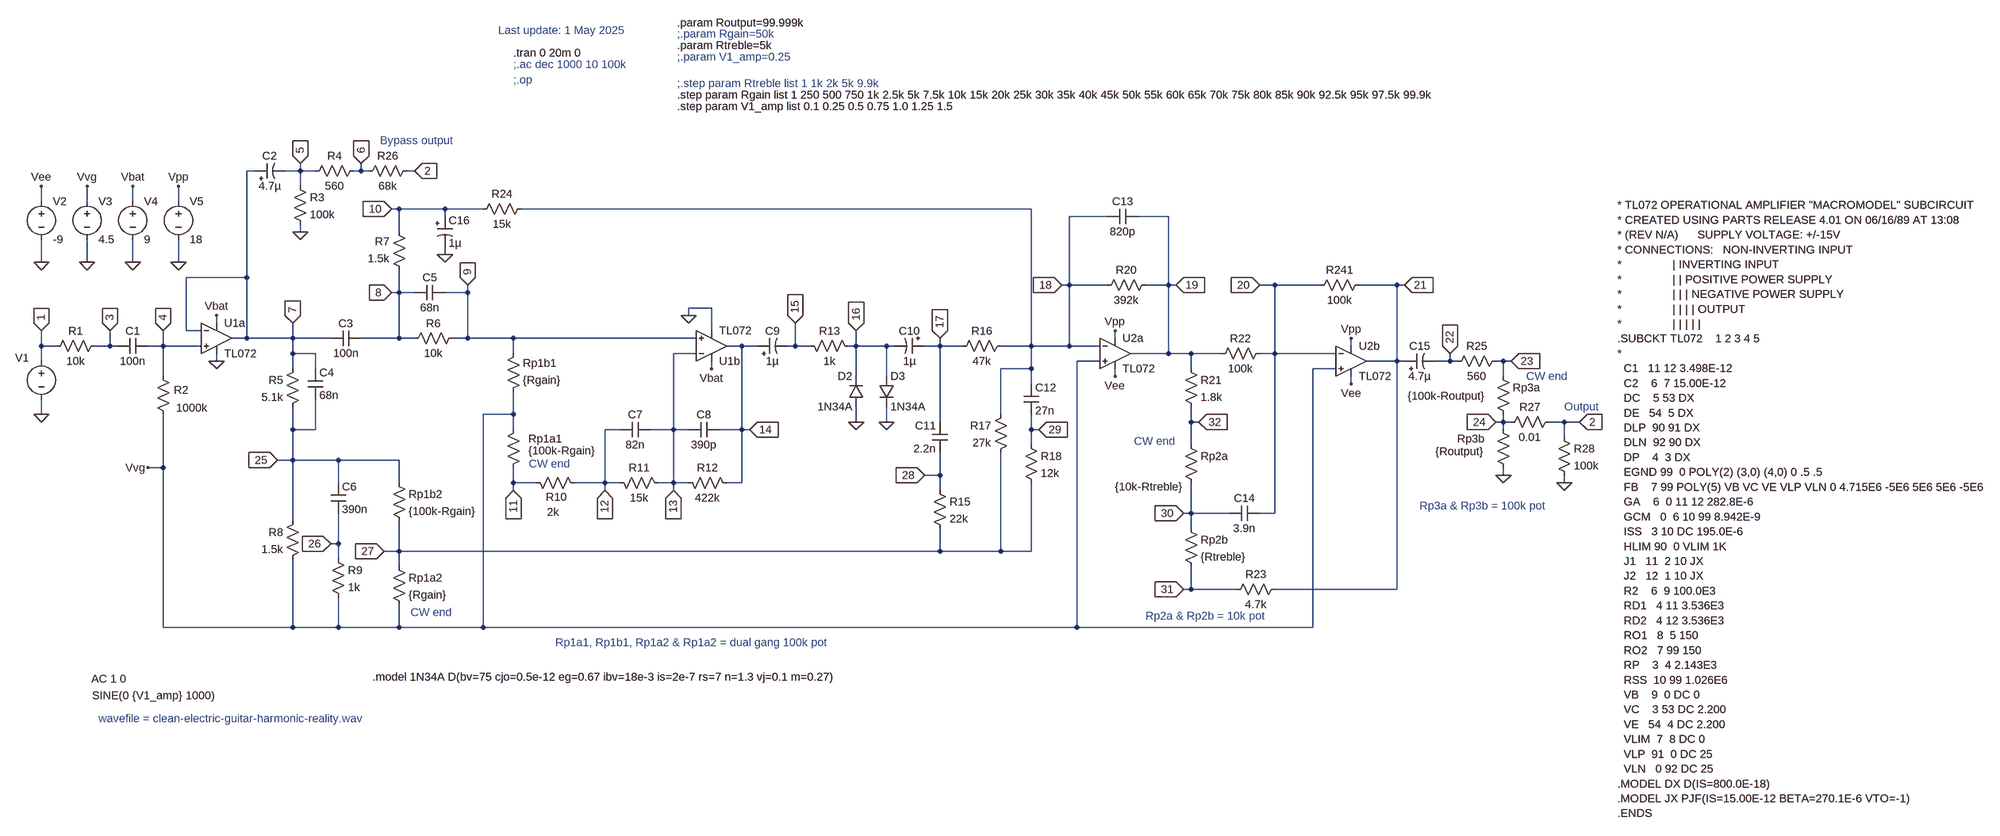
[diagram p0: schematic Klon-Centaur_v2_gain_input_sweep.asc]
Klon-Centaur_v2_gain_input_sweep.asc, the LTspice schematic file:
Version 4
SHEET 1 4760 5064
WIRE -336 2208 -352 2208
WIRE -240 2208 -240 2192
WIRE -240 2208 -272 2208
WIRE -208 2208 -240 2208
WIRE -112 2208 -112 2192
WIRE -112 2208 -128 2208
WIRE -96 2208 -112 2208
WIRE 0 2208 -16 2208
WIRE -240 2240 -240 2208
WIRE -784 2272 -784 2240
WIRE -688 2272 -688 2240
WIRE -592 2272 -592 2240
WIRE -496 2272 -496 2240
WIRE -32 2288 -48 2288
WIRE 64 2288 -32 2288
WIRE 144 2288 64 2288
WIRE 1296 2288 224 2288
WIRE 64 2304 64 2288
WIRE 1456 2304 1376 2304
WIRE 1584 2304 1520 2304
WIRE -240 2336 -240 2320
WIRE -32 2336 -32 2288
WIRE 64 2384 64 2368
WIRE -784 2400 -784 2352
WIRE -688 2400 -688 2352
WIRE -592 2400 -592 2352
WIRE -496 2400 -496 2352
WIRE -352 2432 -352 2208
WIRE -352 2432 -480 2432
WIRE 1376 2448 1376 2304
WIRE 1376 2448 1360 2448
WIRE 1456 2448 1376 2448
WIRE 1584 2448 1584 2304
WIRE 1584 2448 1536 2448
WIRE 1600 2448 1584 2448
WIRE 1808 2448 1776 2448
WIRE 1904 2448 1808 2448
WIRE 2064 2448 1984 2448
WIRE 2080 2448 2064 2448
WIRE -32 2464 -32 2416
WIRE -32 2464 -48 2464
WIRE 0 2464 -32 2464
WIRE 112 2464 112 2448
WIRE 112 2464 64 2464
WIRE 624 2496 576 2496
WIRE 576 2512 576 2496
WIRE -416 2528 -416 2512
WIRE -480 2544 -480 2432
WIRE -448 2544 -480 2544
WIRE 624 2544 624 2496
WIRE -352 2560 -352 2432
WIRE -352 2560 -384 2560
WIRE -256 2560 -256 2528
WIRE -256 2560 -352 2560
WIRE -176 2560 -256 2560
WIRE -32 2560 -32 2464
WIRE -32 2560 -112 2560
WIRE 0 2560 -32 2560
WIRE 112 2560 112 2464
WIRE 112 2560 80 2560
WIRE 208 2560 112 2560
WIRE 592 2560 208 2560
WIRE 1472 2560 1472 2544
WIRE -784 2576 -784 2544
WIRE -752 2576 -784 2576
WIRE -640 2576 -640 2544
WIRE -640 2576 -672 2576
WIRE -624 2576 -640 2576
WIRE -528 2576 -528 2544
WIRE -528 2576 -560 2576
WIRE -448 2576 -528 2576
WIRE 688 2576 656 2576
WIRE 720 2576 688 2576
WIRE 800 2576 800 2528
WIRE 800 2576 784 2576
WIRE 832 2576 800 2576
WIRE 928 2576 928 2544
WIRE 928 2576 912 2576
WIRE 992 2576 928 2576
WIRE 1008 2576 992 2576
WIRE 1104 2576 1104 2560
WIRE 1104 2576 1072 2576
WIRE 1152 2576 1104 2576
WIRE 1296 2576 1296 2288
WIRE 1296 2576 1232 2576
WIRE 1376 2576 1376 2448
WIRE 1376 2576 1296 2576
WIRE 1440 2576 1376 2576
WIRE 1968 2576 1968 2560
WIRE -256 2592 -256 2560
WIRE -208 2592 -256 2592
WIRE 208 2592 208 2560
WIRE 592 2592 544 2592
WIRE 1584 2592 1584 2448
WIRE 1584 2592 1504 2592
WIRE 1632 2592 1584 2592
WIRE 1696 2592 1632 2592
WIRE 1808 2592 1808 2448
WIRE 1808 2592 1776 2592
WIRE 1936 2592 1808 2592
WIRE -784 2608 -784 2576
WIRE -416 2608 -416 2592
WIRE 1440 2608 1392 2608
WIRE 2064 2608 2064 2448
WIRE 2064 2608 2000 2608
WIRE 2080 2608 2064 2608
WIRE 2176 2608 2176 2592
WIRE 2176 2608 2144 2608
WIRE 2192 2608 2176 2608
WIRE 2288 2608 2272 2608
WIRE 2304 2608 2288 2608
WIRE -256 2624 -256 2592
WIRE -208 2624 -208 2592
WIRE 624 2624 624 2608
WIRE 1296 2624 1296 2576
WIRE 1296 2624 1232 2624
WIRE 1632 2624 1632 2592
WIRE 1936 2624 1888 2624
WIRE -528 2640 -528 2576
WIRE 928 2640 928 2576
WIRE 992 2640 992 2576
WIRE 1472 2640 1472 2624
WIRE 2288 2640 2288 2608
WIRE 1296 2656 1296 2624
WIRE 1968 2656 1968 2640
WIRE -784 2720 -784 2688
WIRE 208 2720 208 2672
WIRE 208 2720 144 2720
WIRE 1232 2720 1232 2624
WIRE 928 2736 928 2704
WIRE 992 2736 992 2704
WIRE 1104 2736 1104 2576
WIRE 1632 2736 1632 2704
WIRE 1648 2736 1632 2736
WIRE 2288 2736 2288 2720
WIRE 2288 2736 2272 2736
WIRE 2304 2736 2288 2736
WIRE 2416 2736 2384 2736
WIRE 2448 2736 2416 2736
WIRE -256 2752 -256 2704
WIRE -208 2752 -208 2688
WIRE -208 2752 -256 2752
WIRE 208 2752 208 2720
WIRE 432 2752 400 2752
WIRE 544 2752 544 2592
WIRE 544 2752 496 2752
WIRE 576 2752 544 2752
WIRE 688 2752 688 2576
WIRE 688 2752 640 2752
WIRE 704 2752 688 2752
WIRE 1296 2752 1296 2720
WIRE 1312 2752 1296 2752
WIRE 2288 2752 2288 2736
WIRE 2416 2768 2416 2736
WIRE 1296 2784 1296 2752
WIRE 1632 2784 1632 2736
WIRE -256 2816 -256 2752
WIRE -256 2816 -288 2816
WIRE -160 2816 -256 2816
WIRE -32 2816 -160 2816
WIRE -528 2832 -528 2720
WIRE -528 2832 -560 2832
WIRE 1104 2848 1104 2800
WIRE 1104 2848 1072 2848
WIRE 2288 2848 2288 2832
WIRE -160 2864 -160 2816
WIRE -32 2864 -32 2816
WIRE 208 2864 208 2832
WIRE 256 2864 208 2864
WIRE 400 2864 400 2752
WIRE 400 2864 336 2864
WIRE 432 2864 400 2864
WIRE 544 2864 544 2752
WIRE 544 2864 512 2864
WIRE 576 2864 544 2864
WIRE 688 2864 688 2752
WIRE 688 2864 656 2864
WIRE 2416 2864 2416 2848
WIRE 208 2880 208 2864
WIRE 400 2880 400 2864
WIRE 544 2880 544 2864
WIRE 1104 2880 1104 2848
WIRE 1632 2928 1632 2864
WIRE 1632 2928 1616 2928
WIRE 1712 2928 1632 2928
WIRE 1808 2928 1808 2592
WIRE 1808 2928 1776 2928
WIRE -256 2944 -256 2816
WIRE 1632 2960 1632 2928
WIRE -160 2992 -160 2928
WIRE -160 2992 -176 2992
WIRE -32 3008 -32 2944
WIRE -32 3008 -64 3008
WIRE 1104 3008 1104 2960
WIRE 1104 3008 -32 3008
WIRE 1232 3008 1232 2800
WIRE 1232 3008 1104 3008
WIRE 1296 3008 1296 2864
WIRE 1296 3008 1232 3008
WIRE -160 3024 -160 2992
WIRE -32 3040 -32 3008
WIRE 1632 3088 1632 3040
WIRE 1632 3088 1616 3088
WIRE 1728 3088 1632 3088
WIRE 2064 3088 2064 2608
WIRE 2064 3088 1808 3088
WIRE -528 3168 -528 2832
WIRE -256 3168 -256 3024
WIRE -256 3168 -528 3168
WIRE -160 3168 -160 3104
WIRE -160 3168 -256 3168
WIRE -32 3168 -32 3120
WIRE -32 3168 -160 3168
WIRE 144 3168 144 2720
WIRE 144 3168 -32 3168
WIRE 1392 3168 1392 2608
WIRE 1392 3168 144 3168
WIRE 1888 3168 1888 2624
WIRE 1888 3168 1392 3168
FLAG -784 2544 1
IOPIN -784 2544 In
FLAG 992 2736 0
FLAG 928 2736 0
FLAG 64 2384 0
FLAG 2448 2736 2
IOPIN 2448 2736 In
FLAG -784 2720 0
FLAG 2416 2864 0
FLAG -640 2544 3
IOPIN -640 2544 In
FLAG -528 2544 4
IOPIN -528 2544 In
FLAG -256 2528 7
IOPIN -256 2528 In
FLAG -48 2464 8
IOPIN -48 2464 In
FLAG -48 2288 10
IOPIN -48 2288 In
FLAG 112 2448 9
IOPIN 112 2448 In
FLAG 800 2528 15
IOPIN 800 2528 In
FLAG 928 2544 16
IOPIN 928 2544 In
FLAG 1104 2560 17
IOPIN 1104 2560 In
FLAG 1072 2848 28
IOPIN 1072 2848 In
FLAG 1312 2752 29
IOPIN 1312 2752 In
FLAG -64 3008 27
IOPIN -64 3008 In
FLAG -176 2992 26
IOPIN -176 2992 In
FLAG -288 2816 25
IOPIN -288 2816 In
FLAG 1648 2736 32
IOPIN 1648 2736 In
FLAG 1616 2928 30
IOPIN 1616 2928 In
FLAG 1616 3088 31
IOPIN 1616 3088 In
FLAG 1360 2448 18
IOPIN 1360 2448 In
FLAG 1600 2448 19
IOPIN 1600 2448 In
FLAG 1776 2448 20
IOPIN 1776 2448 In
FLAG 2080 2448 21
IOPIN 2080 2448 In
FLAG 2176 2592 22
IOPIN 2176 2592 In
FLAG -784 2400 0
FLAG -688 2400 0
FLAG -592 2400 0
FLAG -496 2400 0
FLAG -784 2240 Vee
FLAG -688 2240 Vvg
FLAG -592 2240 Vbat
FLAG -496 2240 Vpp
FLAG -416 2512 Vbat
FLAG 624 2624 Vbat
FLAG -416 2608 0
FLAG 576 2512 0
FLAG 1472 2544 Vpp
FLAG 1968 2560 Vpp
FLAG 1472 2640 Vee
FLAG 1968 2656 Vee
FLAG -560 2832 Vvg
FLAG -240 2336 0
FLAG -240 2192 5
IOPIN -240 2192 In
FLAG 0 2208 2
IOPIN 0 2208 In
FLAG -112 2192 6
IOPIN -112 2192 In
FLAG 2288 2848 0
FLAG 2272 2736 24
IOPIN 2272 2736 In
FLAG 2304 2608 23
IOPIN 2304 2608 In
FLAG 208 2880 11
IOPIN 208 2880 In
FLAG 400 2880 12
IOPIN 400 2880 In
FLAG 544 2880 13
IOPIN 544 2880 In
FLAG 704 2752 14
IOPIN 704 2752 In
SYMBOL voltage -784 2592 R0
WINDOW 0 -55 9 Left 2
WINDOW 123 105 684 Left 2
WINDOW 39 0 0 Left 0
WINDOW 3 107 719 Left 2
SYMATTR InstName V1
SYMATTR Value2 AC 1 0
SYMATTR Value SINE(0 {V1_amp} 1000)
SYMBOL res -656 2560 R90
WINDOW 0 0 56 VBottom 2
WINDOW 3 32 56 VTop 2
SYMATTR InstName R1
SYMATTR Value 10k
SYMBOL res -512 2736 R180
WINDOW 0 -37 67 Left 2
WINDOW 3 -77 30 Left 2
SYMATTR InstName R2
SYMATTR Value 1000k
SYMBOL cap -560 2560 R90
WINDOW 0 0 32 VBottom 2
WINDOW 3 32 32 VTop 2
SYMATTR InstName C1
SYMATTR Value 100n
SYMBOL res -240 2608 M0
SYMATTR InstName R5
SYMATTR Value 5.1k
SYMBOL res -240 2928 M0
SYMATTR InstName R8
SYMATTR Value 1.5k
SYMBOL cap -112 2544 R90
WINDOW 0 0 32 VBottom 2
WINDOW 3 32 32 VTop 2
SYMATTR InstName C3
SYMATTR Value 100n
SYMBOL cap -224 2624 R0
SYMATTR InstName C4
SYMATTR Value 68n
SYMBOL cap -176 2864 R0
SYMATTR InstName C6
SYMATTR Value 390n
SYMBOL res -176 3008 R0
SYMATTR InstName R9
SYMATTR Value 1k
SYMBOL res 96 2544 R90
WINDOW 0 0 56 VBottom 2
WINDOW 3 32 56 VTop 2
SYMATTR InstName R6
SYMATTR Value 10k
SYMBOL cap 64 2448 R90
WINDOW 0 0 32 VBottom 2
WINDOW 3 32 32 VTop 2
SYMATTR InstName C5
SYMATTR Value 68n
SYMBOL res -48 2848 R0
SYMATTR InstName Rp1b2
SYMATTR Value {100k-Rgain}
SYMBOL res -48 3024 R0
SYMATTR InstName Rp1a2
SYMATTR Value {Rgain}
SYMBOL res 928 2592 M270
WINDOW 0 32 56 VTop 2
WINDOW 3 0 56 VBottom 2
SYMATTR InstName R13
SYMATTR Value 1k
SYMBOL cap 1120 2736 M0
SYMATTR InstName C11
SYMATTR Value 2.2n
SYMBOL res 1088 2864 R0
SYMATTR InstName R15
SYMATTR Value 22k
SYMBOL res 1248 2704 M0
SYMATTR InstName R17
SYMATTR Value 27k
SYMBOL res 1280 2768 R0
SYMATTR InstName R18
SYMATTR Value 12k
SYMBOL cap 1280 2656 R0
SYMATTR InstName C12
SYMATTR Value 27n
SYMBOL res 1248 2560 R90
WINDOW 0 0 56 VBottom 2
WINDOW 3 32 56 VTop 2
SYMATTR InstName R16
SYMATTR Value 47k
SYMBOL res -16 2432 R180
WINDOW 0 36 76 Left 2
WINDOW 3 36 40 Left 2
SYMATTR InstName R7
SYMATTR Value 1.5k
SYMBOL res 240 2272 R90
WINDOW 0 0 56 VBottom 2
WINDOW 3 32 56 VTop 2
SYMATTR InstName R24
SYMATTR Value 15k
SYMBOL res 1552 2432 R90
WINDOW 0 0 56 VBottom 2
WINDOW 3 32 56 VTop 2
SYMATTR InstName R20
SYMATTR Value 392k
SYMBOL cap 1520 2288 R90
WINDOW 0 0 32 VBottom 2
WINDOW 3 32 32 VTop 2
SYMATTR InstName C13
SYMATTR Value 820p
SYMBOL res 1616 2608 R0
SYMATTR InstName R21
SYMATTR Value 1.8k
SYMBOL res 1792 2576 R90
WINDOW 0 0 56 VBottom 2
WINDOW 3 32 56 VTop 2
SYMATTR InstName R22
SYMATTR Value 100k
SYMBOL res 1616 2768 R0
WINDOW 3 -2 104 Right 2
SYMATTR Value {10k-Rtreble}
SYMATTR InstName Rp2a
SYMBOL res 1616 2944 R0
SYMATTR InstName Rp2b
SYMATTR Value {Rtreble}
SYMBOL cap 1776 2912 R90
WINDOW 0 0 32 VBottom 2
WINDOW 3 32 32 VTop 2
SYMATTR InstName C14
SYMATTR Value 3.9n
SYMBOL res 2000 2432 R90
WINDOW 0 0 56 VBottom 2
WINDOW 3 32 56 VTop 2
SYMATTR InstName R241
SYMATTR Value 100k
SYMBOL res 2288 2592 R90
WINDOW 0 0 56 VBottom 2
WINDOW 3 32 56 VTop 2
SYMATTR InstName R25
SYMATTR Value 560
SYMBOL res 1824 3072 R90
WINDOW 0 0 56 VBottom 2
WINDOW 3 32 56 VTop 2
SYMATTR InstName R23
SYMATTR Value 4.7k
SYMBOL res 2400 2752 R0
SYMATTR InstName R28
SYMATTR Value 100k
SYMBOL diode 944 2704 R180
WINDOW 0 24 64 Left 2
WINDOW 3 24 0 Left 2
SYMATTR InstName D2
SYMATTR Value 1N34A
SYMBOL diode 976 2640 R0
SYMATTR InstName D3
SYMATTR Value 1N34A
SYMBOL polcap 48 2304 R0
SYMATTR InstName C16
SYMATTR Value 1µ
SYMBOL polcap 720 2592 R270
WINDOW 0 32 32 VTop 2
WINDOW 3 0 32 VBottom 2
SYMATTR InstName C9
SYMATTR Value 1µ
SYMBOL polcap 1072 2560 R90
WINDOW 0 0 32 VBottom 2
WINDOW 3 32 32 VTop 2
SYMATTR InstName C10
SYMATTR Value 1µ
SYMBOL polcap 2080 2624 R270
WINDOW 0 32 32 VTop 2
WINDOW 3 0 32 VBottom 2
SYMATTR InstName C15
SYMATTR Value 4.7µ
SYMBOL voltage -784 2256 R0
WINDOW 123 0 0 Left 0
WINDOW 39 0 0 Left 0
SYMATTR InstName V2
SYMATTR Value -9
SYMBOL voltage -688 2256 R0
WINDOW 123 0 0 Left 0
WINDOW 39 0 0 Left 0
SYMATTR InstName V3
SYMATTR Value 4.5
SYMBOL voltage -592 2256 R0
WINDOW 123 0 0 Left 0
WINDOW 39 0 0 Left 0
SYMATTR InstName V4
SYMATTR Value 9
SYMBOL voltage -496 2256 R0
WINDOW 123 0 0 Left 0
WINDOW 39 0 0 Left 0
SYMATTR InstName V5
SYMATTR Value 18
SYMBOL OpAmps\\opamp2 -416 2496 R0
SYMATTR InstName U1a
SYMATTR Value TL072
SYMBOL OpAmps\\opamp2 624 2640 M180
SYMATTR InstName U1b
SYMATTR Value TL072
SYMBOL OpAmps\\opamp2 1472 2528 R0
SYMATTR InstName U2a
SYMATTR Value TL072
SYMBOL OpAmps\\opamp2 1968 2544 R0
SYMATTR InstName U2b
SYMATTR Value TL072
SYMBOL res -256 2224 R0
SYMATTR InstName R3
SYMATTR Value 100k
SYMBOL res -112 2192 R90
WINDOW 0 0 56 VBottom 2
WINDOW 3 32 56 VTop 2
SYMATTR InstName R4
SYMATTR Value 560
SYMBOL polcap -336 2224 R270
WINDOW 0 32 32 VTop 2
WINDOW 3 0 32 VBottom 2
SYMATTR InstName C2
SYMATTR Value 4.7µ
SYMBOL res 0 2192 R90
WINDOW 0 0 56 VBottom 2
WINDOW 3 32 56 VTop 2
SYMATTR InstName R26
SYMATTR Value 68k
SYMBOL res 2272 2624 R0
WINDOW 3 -185 57 Left 2
SYMATTR Value {100k-Routput}
SYMATTR InstName Rp3a
SYMBOL res 2272 2736 R0
WINDOW 0 -81 35 Left 2
WINDOW 3 -127 62 Left 2
SYMATTR InstName Rp3b
SYMATTR Value {Routput}
SYMBOL res 2400 2720 R90
WINDOW 0 0 56 VBottom 2
WINDOW 3 32 56 VTop 2
SYMATTR InstName R27
SYMATTR Value 0.01
SYMBOL res 192 2848 M180
WINDOW 0 47 77 Left 2
WINDOW 3 47 52 Left 2
SYMATTR InstName Rp1a1
SYMATTR Value {100k-Rgain}
SYMBOL res 192 2688 M180
WINDOW 0 36 76 Left 2
WINDOW 3 36 40 Left 2
SYMATTR InstName Rp1b1
SYMATTR Value {Rgain}
SYMBOL res 352 2880 M270
WINDOW 0 -29 54 VTop 2
WINDOW 3 -30 61 VBottom 2
SYMATTR InstName R10
SYMATTR Value 2k
SYMBOL res 528 2880 M270
WINDOW 0 32 56 VTop 2
WINDOW 3 0 56 VBottom 2
SYMATTR InstName R11
SYMATTR Value 15k
SYMBOL cap 496 2768 M270
WINDOW 0 32 32 VTop 2
WINDOW 3 0 32 VBottom 2
SYMATTR InstName C7
SYMATTR Value 82n
SYMBOL cap 640 2768 M270
WINDOW 0 32 32 VTop 2
WINDOW 3 0 32 VBottom 2
SYMATTR InstName C8
SYMATTR Value 390p
SYMBOL res 672 2880 M270
WINDOW 0 32 56 VTop 2
WINDOW 3 0 56 VBottom 2
SYMATTR InstName R12
SYMATTR Value 422k
TEXT 552 1920 Left 2 ;;.param Rgain=50k
TEXT 552 1944 Left 2 !.param Rtreble=5k
TEXT 208 1984 Left 2 ;;.ac dec 1000 10 100k
TEXT 1512 2776 Left 2 ;CW end
TEXT -8 3136 Left 2 ;CW end
TEXT 552 2024 Left 2 ;;.step param Rtreble list 1 1k 2k 5k 9.9k
TEXT 2416 2704 Left 2 ;Output
TEXT 1536 3144 Left 2 ;Rp2a & Rp2b = 10k pot
TEXT 296 3200 Left 2 ;Rp1a1, Rp1b1, Rp1a2 & Rp1a2 = dual gang 100k pot
TEXT -88 3272 Left 2 !.model 1N34A D(bv=75 cjo=0.5e-12 eg=0.67 ibv=18e-3 is=2e-7 rs=7 n=1.3 vj=0.1 m=0.27)
TEXT 208 1960 Left 2 !.tran 0 20m 0
TEXT 2528 2280 Left 2 !* TL072 OPERATIONAL AMPLIFIER "MACROMODEL" SUBCIRCUIT\n* CREATED USING PARTS RELEASE 4.01 ON 06/16/89 AT 13:08\n* (REV N/A)      SUPPLY VOLTAGE: +/-15V\n* CONNECTIONS:   NON-INVERTING INPUT\n*                | INVERTING INPUT\n*                | | POSITIVE POWER SUPPLY\n*                | | | NEGATIVE POWER SUPPLY\n*                | | | | OUTPUT\n*                | | | | |\n.SUBCKT TL072    1 2 3 4 5\n*\n  C1   11 12 3.498E-12\n  C2    6  7 15.00E-12\n  DC    5 53 DX\n  DE   54  5 DX\n  DLP  90 91 DX\n  DLN  92 90 DX\n  DP    4  3 DX\n  EGND 99  0 POLY(2) (3,0) (4,0) 0 .5 .5\n  FB    7 99 POLY(5) VB VC VE VLP VLN 0 4.715E6 -5E6 5E6 5E6 -5E6\n  GA    6  0 11 12 282.8E-6\n  GCM   0  6 10 99 8.942E-9\n  ISS   3 10 DC 195.0E-6\n  HLIM 90  0 VLIM 1K\n  J1   11  2 10 JX\n  J2   12  1 10 JX\n  R2    6  9 100.0E3\n  RD1   4 11 3.536E3\n  RD2   4 12 3.536E3\n  RO1   8  5 150\n  RO2   7 99 150\n  RP    3  4 2.143E3\n  RSS  10 99 1.026E6\n  VB    9  0 DC 0\n  VC    3 53 DC 2.200\n  VE   54  4 DC 2.200\n  VLIM  7  8 DC 0\n  VLP  91  0 DC 25\n  VLN   0 92 DC 25\n.MODEL DX D(IS=800.0E-18)\n.MODEL JX PJF(IS=15.00E-12 BETA=270.1E-6 VTO=-1)\n.ENDS
TEXT -72 2144 Left 2 ;Bypass output
TEXT 552 1896 Left 2 !.param Routput=99.999k
TEXT 2336 2640 Left 2 ;CW end
TEXT 2112 2912 Left 2 ;Rp3a & Rp3b = 100k pot
TEXT 240 2824 Left 2 ;CW end
TEXT 176 1912 Left 2 ;Last update: 1 May 2025
TEXT 552 2072 Left 2 !.step param V1_amp list 0.1 0.25 0.5 0.75 1.0 1.25 1.5
TEXT 552 2048 Left 2 !.step param Rgain list 1 250 500 750 1k 2.5k 5k 7.5k 10k 15k 20k 25k 30k 35k 40k 45k 50k 55k 60k 65k 70k 75k 80k 85k 90k 92.5k 95k 97.5k 99.9k
TEXT 552 1968 Left 2 ;;.param V1_amp=0.25
TEXT 208 2016 Left 2 ;;.op
TEXT -664 3360 Left 2 ;wavefile = clean-electric-guitar-harmonic-reality.wav

The netlist it stands for:
* Klon-Centaur_v2_gain_input_sweep.asc
V1 1 0 SINE(0 {V1_amp} 1000) AC 1 0
R1 3 1 10k
R2 Vvg 4 1000k
C1 4 3 100n
R5 7 25 5.1k
R8 25 Vvg 1.5k
C3 8 7 100n
C4 7 25 68n
C6 25 26 390n
R9 26 Vvg 1k
R6 9 8 10k
C5 9 8 68n
Rp1b2 25 27 {100k-Rgain}
Rp1a2 27 Vvg {Rgain}
R13 16 15 1k
C11 17 28 2.2n
R15 28 27 22k
R17 18 27 27k
R18 29 27 12k
C12 18 29 27n
R16 18 17 47k
R7 8 10 1.5k
R24 18 10 15k
R20 19 18 392k
C13 19 18 820p
R21 19 32 1.8k
R22 20 19 100k
Rp2a 32 30 {10k-Rtreble}
Rp2b 30 31 {Rtreble}
C14 20 30 3.9n
R241 21 20 100k
R25 23 22 560
R23 21 31 4.7k
R28 2 0 100k
D2 0 16 1N34A
D3 16 0 1N34A
C16 10 0 1µ
C9 14 15 1µ
C10 17 16 1µ
C15 21 22 4.7µ
V2 Vee 0 -9
V3 Vvg 0 4.5
V4 Vbat 0 9
V5 Vpp 0 18
XU1a 4 7 Vbat 0 7 TL072  ; pins In+ In- V+ V- OUT
XU1b 9 13 Vbat 0 14 TL072  ; pins In+ In- V+ V- OUT
XU2a Vvg 18 Vpp Vee 19 TL072  ; pins In+ In- V+ V- OUT
XU2b Vvg 20 Vpp Vee 21 TL072  ; pins In+ In- V+ V- OUT
R3 5 0 100k
R4 6 5 560
C2 7 5 4.7µ
R26 2 6 68k
Rp3a 23 24 {100k-Routput}
Rp3b 24 0 {Routput}
R27 2 24 0.01
Rp1a1 11 Vvg {100k-Rgain}
Rp1b1 Vvg 9 {Rgain}
R10 12 11 2k
R11 13 12 15k
C7 13 12 82n
C8 14 13 390p
R12 14 13 422k
.model D D
.lib standard.dio
* ;.param Rgain=50k
.param Rtreble=5k
* ;.ac dec 1000 10 100k
* CW end
* CW end
* ;.step param Rtreble list 1 1k 2k 5k 9.9k
* Output
* Rp2a & Rp2b = 10k pot
* Rp1a1, Rp1b1, Rp1a2 & Rp1a2 = dual gang 100k pot
.model 1N34A D(bv=75 cjo=0.5e-12 eg=0.67 ibv=18e-3 is=2e-7 rs=7 n=1.3 vj=0.1 m=0.27)
.tran 0 20m 0
* TL072 OPERATIONAL AMPLIFIER "MACROMODEL" SUBCIRCUIT
* CREATED USING PARTS RELEASE 4.01 ON 06/16/89 AT 13:08
* (REV N/A)      SUPPLY VOLTAGE: +/-15V
* CONNECTIONS:   NON-INVERTING INPUT
*                | INVERTING INPUT
*                | | POSITIVE POWER SUPPLY
*                | | | NEGATIVE POWER SUPPLY
*                | | | | OUTPUT
*                | | | | |
.SUBCKT TL072    1 2 3 4 5
*
  C1   11 12 3.498E-12
  C2    6  7 15.00E-12
  DC    5 53 DX
  DE   54  5 DX
  DLP  90 91 DX
  DLN  92 90 DX
  DP    4  3 DX
  EGND 99  0 POLY(2) (3,0) (4,0) 0 .5 .5
  FB    7 99 POLY(5) VB VC VE VLP VLN 0 4.715E6 -5E6 5E6 5E6 -5E6
  GA    6  0 11 12 282.8E-6
  GCM   0  6 10 99 8.942E-9
  ISS   3 10 DC 195.0E-6
  HLIM 90  0 VLIM 1K
  J1   11  2 10 JX
  J2   12  1 10 JX
  R2    6  9 100.0E3
  RD1   4 11 3.536E3
  RD2   4 12 3.536E3
  RO1   8  5 150
  RO2   7 99 150
  RP    3  4 2.143E3
  RSS  10 99 1.026E6
  VB    9  0 DC 0
  VC    3 53 DC 2.200
  VE   54  4 DC 2.200
  VLIM  7  8 DC 0
  VLP  91  0 DC 25
  VLN   0 92 DC 25
.MODEL DX D(IS=800.0E-18)
.MODEL JX PJF(IS=15.00E-12 BETA=270.1E-6 VTO=-1)
.ENDS
* Bypass output
.param Routput=99.999k
* CW end
* Rp3a & Rp3b = 100k pot
* CW end
* Last update: 1 May 2025
.step param V1_amp list 0.1 0.25 0.5 0.75 1.0 1.25 1.5
.step param Rgain list 1 250 500 750 1k 2.5k 5k 7.5k 10k 15k 20k 25k 30k 35k 40k 45k 50k 55k 60k 65k 70k 75k 80k 85k 90k 92.5k 95k 97.5k 99.9k
* ;.param V1_amp=0.25
* ;.op
* wavefile = clean-electric-guitar-harmonic-reality.wav
.backanno
.end